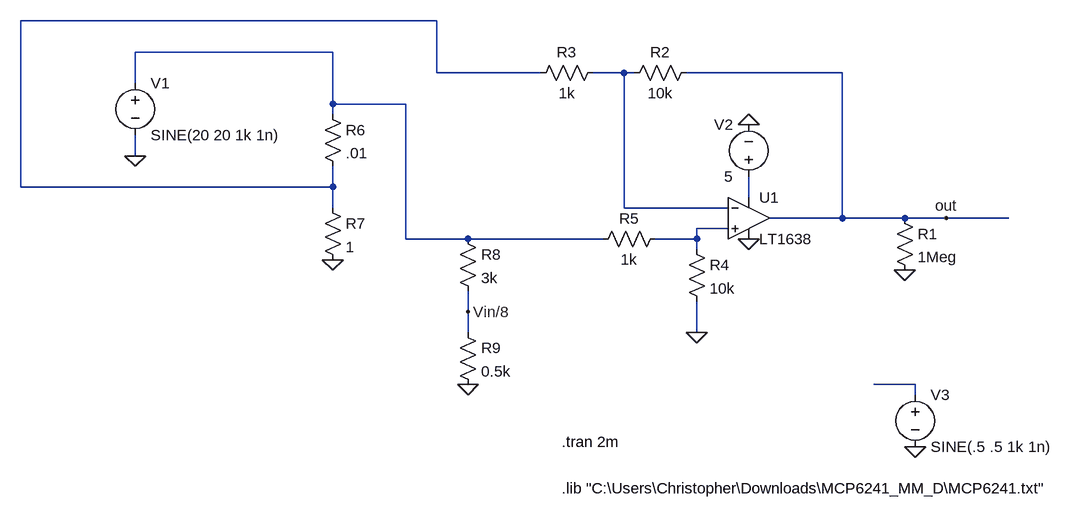
[diagram p0: schematic differential_amplifier.asc]
differential_amplifier.asc, the LTspice schematic file:
Version 4.1
SHEET 1 1312 680
WIRE 16 -144 -624 -144
WIRE -144 -96 -448 -96
WIRE 16 -64 16 -144
WIRE 176 -64 16 -64
WIRE 304 -64 256 -64
WIRE 320 -64 304 -64
WIRE 640 -64 400 -64
WIRE -448 -48 -448 -96
WIRE -144 -16 -144 -96
WIRE -32 -16 -144 -16
WIRE -144 0 -144 -16
WIRE -448 64 -448 32
WIRE -624 112 -624 -144
WIRE -144 112 -144 80
WIRE -144 112 -624 112
WIRE 496 128 496 96
WIRE -144 144 -144 112
WIRE 304 144 304 -64
WIRE 464 144 304 144
WIRE 640 160 640 -64
WIRE 640 160 528 160
WIRE 736 160 640 160
WIRE 800 160 736 160
WIRE 896 160 800 160
WIRE 464 176 416 176
WIRE -32 192 -32 -16
WIRE 64 192 -32 192
WIRE 272 192 64 192
WIRE 416 192 416 176
WIRE 416 192 352 192
WIRE 416 208 416 192
WIRE 64 304 64 272
WIRE 64 336 64 304
WIRE 416 336 416 288
WIRE 752 416 688 416
WIRE 752 432 752 416
FLAG 496 192 0
FLAG 496 16 0
FLAG 800 160 out
FLAG 736 240 0
FLAG -448 64 0
FLAG 416 336 0
FLAG 752 512 0
FLAG -144 224 0
FLAG 64 416 0
FLAG 64 304 Vin/8
SYMBOL voltage 496 112 R180
WINDOW 0 24 96 Left 2
WINDOW 3 24 16 Left 2
SYMATTR InstName V2
SYMATTR Value 5
SYMBOL res 720 144 R0
SYMATTR InstName R1
SYMATTR Value 1Meg
SYMBOL res 416 -80 R90
WINDOW 0 0 56 VBottom 2
WINDOW 3 32 56 VTop 2
SYMATTR InstName R2
SYMATTR Value 10k
SYMBOL res 272 -80 R90
WINDOW 0 0 56 VBottom 2
WINDOW 3 32 56 VTop 2
SYMATTR InstName R3
SYMATTR Value 1k
SYMBOL voltage -448 -64 R0
WINDOW 123 0 0 Left 0
WINDOW 39 0 0 Left 0
SYMATTR InstName V1
SYMATTR Value SINE(20 20 1k 1n)
SYMBOL res 400 192 R0
SYMATTR InstName R4
SYMATTR Value 10k
SYMBOL res 368 176 R90
WINDOW 0 0 56 VBottom 2
WINDOW 3 32 56 VTop 2
SYMATTR InstName R5
SYMATTR Value 1k
SYMBOL voltage 752 416 R0
WINDOW 123 0 0 Left 0
WINDOW 39 0 0 Left 0
SYMATTR InstName V3
SYMATTR Value SINE(.5 .5 1k 1n)
SYMBOL res -160 -16 R0
SYMATTR InstName R6
SYMATTR Value .01
SYMBOL res -160 128 R0
SYMATTR InstName R7
SYMATTR Value 1
SYMBOL OpAmps\\LT1638 496 96 R0
SYMATTR InstName U1
SYMBOL res 48 176 R0
SYMATTR InstName R8
SYMATTR Value 3k
SYMBOL res 48 320 R0
SYMATTR InstName R9
SYMATTR Value 0.5k
TEXT 208 576 Left 2 !.lib "C:\\Users\\Christopher\\Downloads\\MCP6241_MM_D\\MCP6241.txt"
TEXT 208 504 Left 2 !.tran 2m

The netlist it stands for:
* differential_amplifier.asc
V2 N004 0 5
R1 out 0 1Meg
R2 out N003 10k
R3 N003 N001 1k
V1 N002 0 SINE(20 20 1k 1n)
R4 N005 0 10k
R5 N005 N002 1k
V3 N006 0 SINE(.5 .5 1k 1n)
R6 N002 N001 .01
R7 N001 0 1
X§U1 N005 N003 N004 0 out LT1638  ; pins In+ In- V+ V- OUT
R8 N002 Vin/8 3k
R9 Vin/8 0 0.5k
.lib "C:\Users\Christopher\Downloads\MCP6241_MM_D\MCP6241.txt"
.tran 2m
.backanno
.end